# Altium schematic sheet debug-fpc.SchDoc
size A
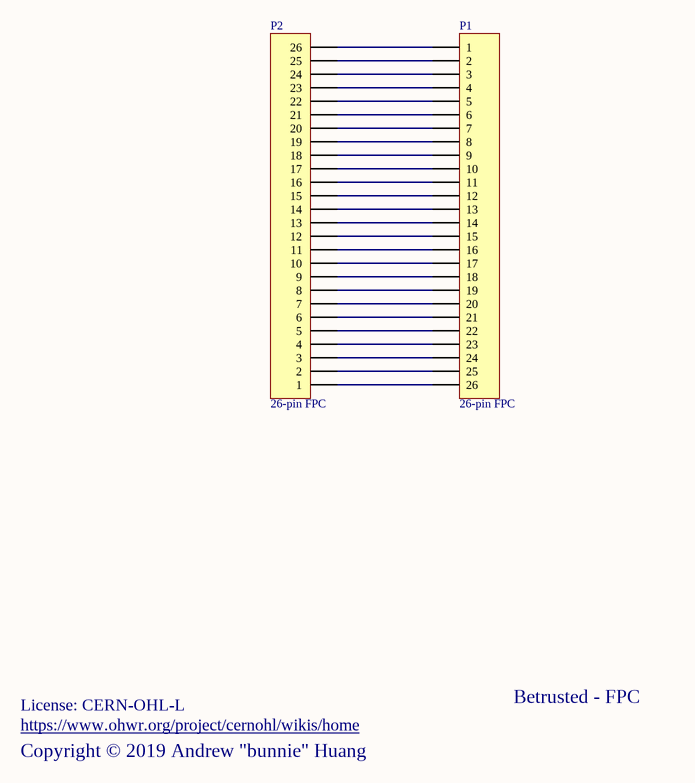
[diagram p0: debug-fpc.SchDoc]

## Parts
P1  26-pin FPC  [HRS_FH34SRJ-26S-FPC]
P2  26-pin FPC  [HRS_FH34SRJ-26S-FPC]

## Nets
NetP1_1: P1.1 P2.26
NetP1_2: P1.2 P2.25
NetP1_3: P1.3 P2.24
NetP1_4: P1.4 P2.23
NetP1_5: P1.5 P2.22
NetP1_6: P1.6 P2.21
NetP1_7: P1.7 P2.20
NetP1_8: P1.8 P2.19
NetP1_9: P1.9 P2.18
NetP1_10: P1.10 P2.17
NetP1_11: P1.11 P2.16
NetP1_12: P1.12 P2.15
NetP1_13: P1.13 P2.14
NetP1_14: P1.14 P2.13
NetP1_15: P1.15 P2.12
NetP1_16: P1.16 P2.11
NetP1_17: P1.17 P2.10
NetP1_18: P1.18 P2.9
NetP1_19: P1.19 P2.8
NetP1_20: P1.20 P2.7
NetP1_21: P1.21 P2.6
NetP1_22: P1.22 P2.5
NetP1_23: P1.23 P2.4
NetP1_24: P1.24 P2.3
NetP1_25: P1.25 P2.2
NetP1_26: P1.26 P2.1

## Notes on the sheet
- License: CERN-OHL-L
- Copyright © 2019 Andrew "bunnie" Huang
- https://www.ohwr.org/project/cernohl/wikis/home
- Betrusted - FPC

## Library data of the parts
P1 P2 = FPC-26: 26 Pin FPC footprint; MPN: DNP; VENDOR: FPC pattern; System: Connector; MYPN: DNP